# Altium schematic sheet Sensors.SchDoc
size A3; SheetNumber: 2; SheetTotal: 3
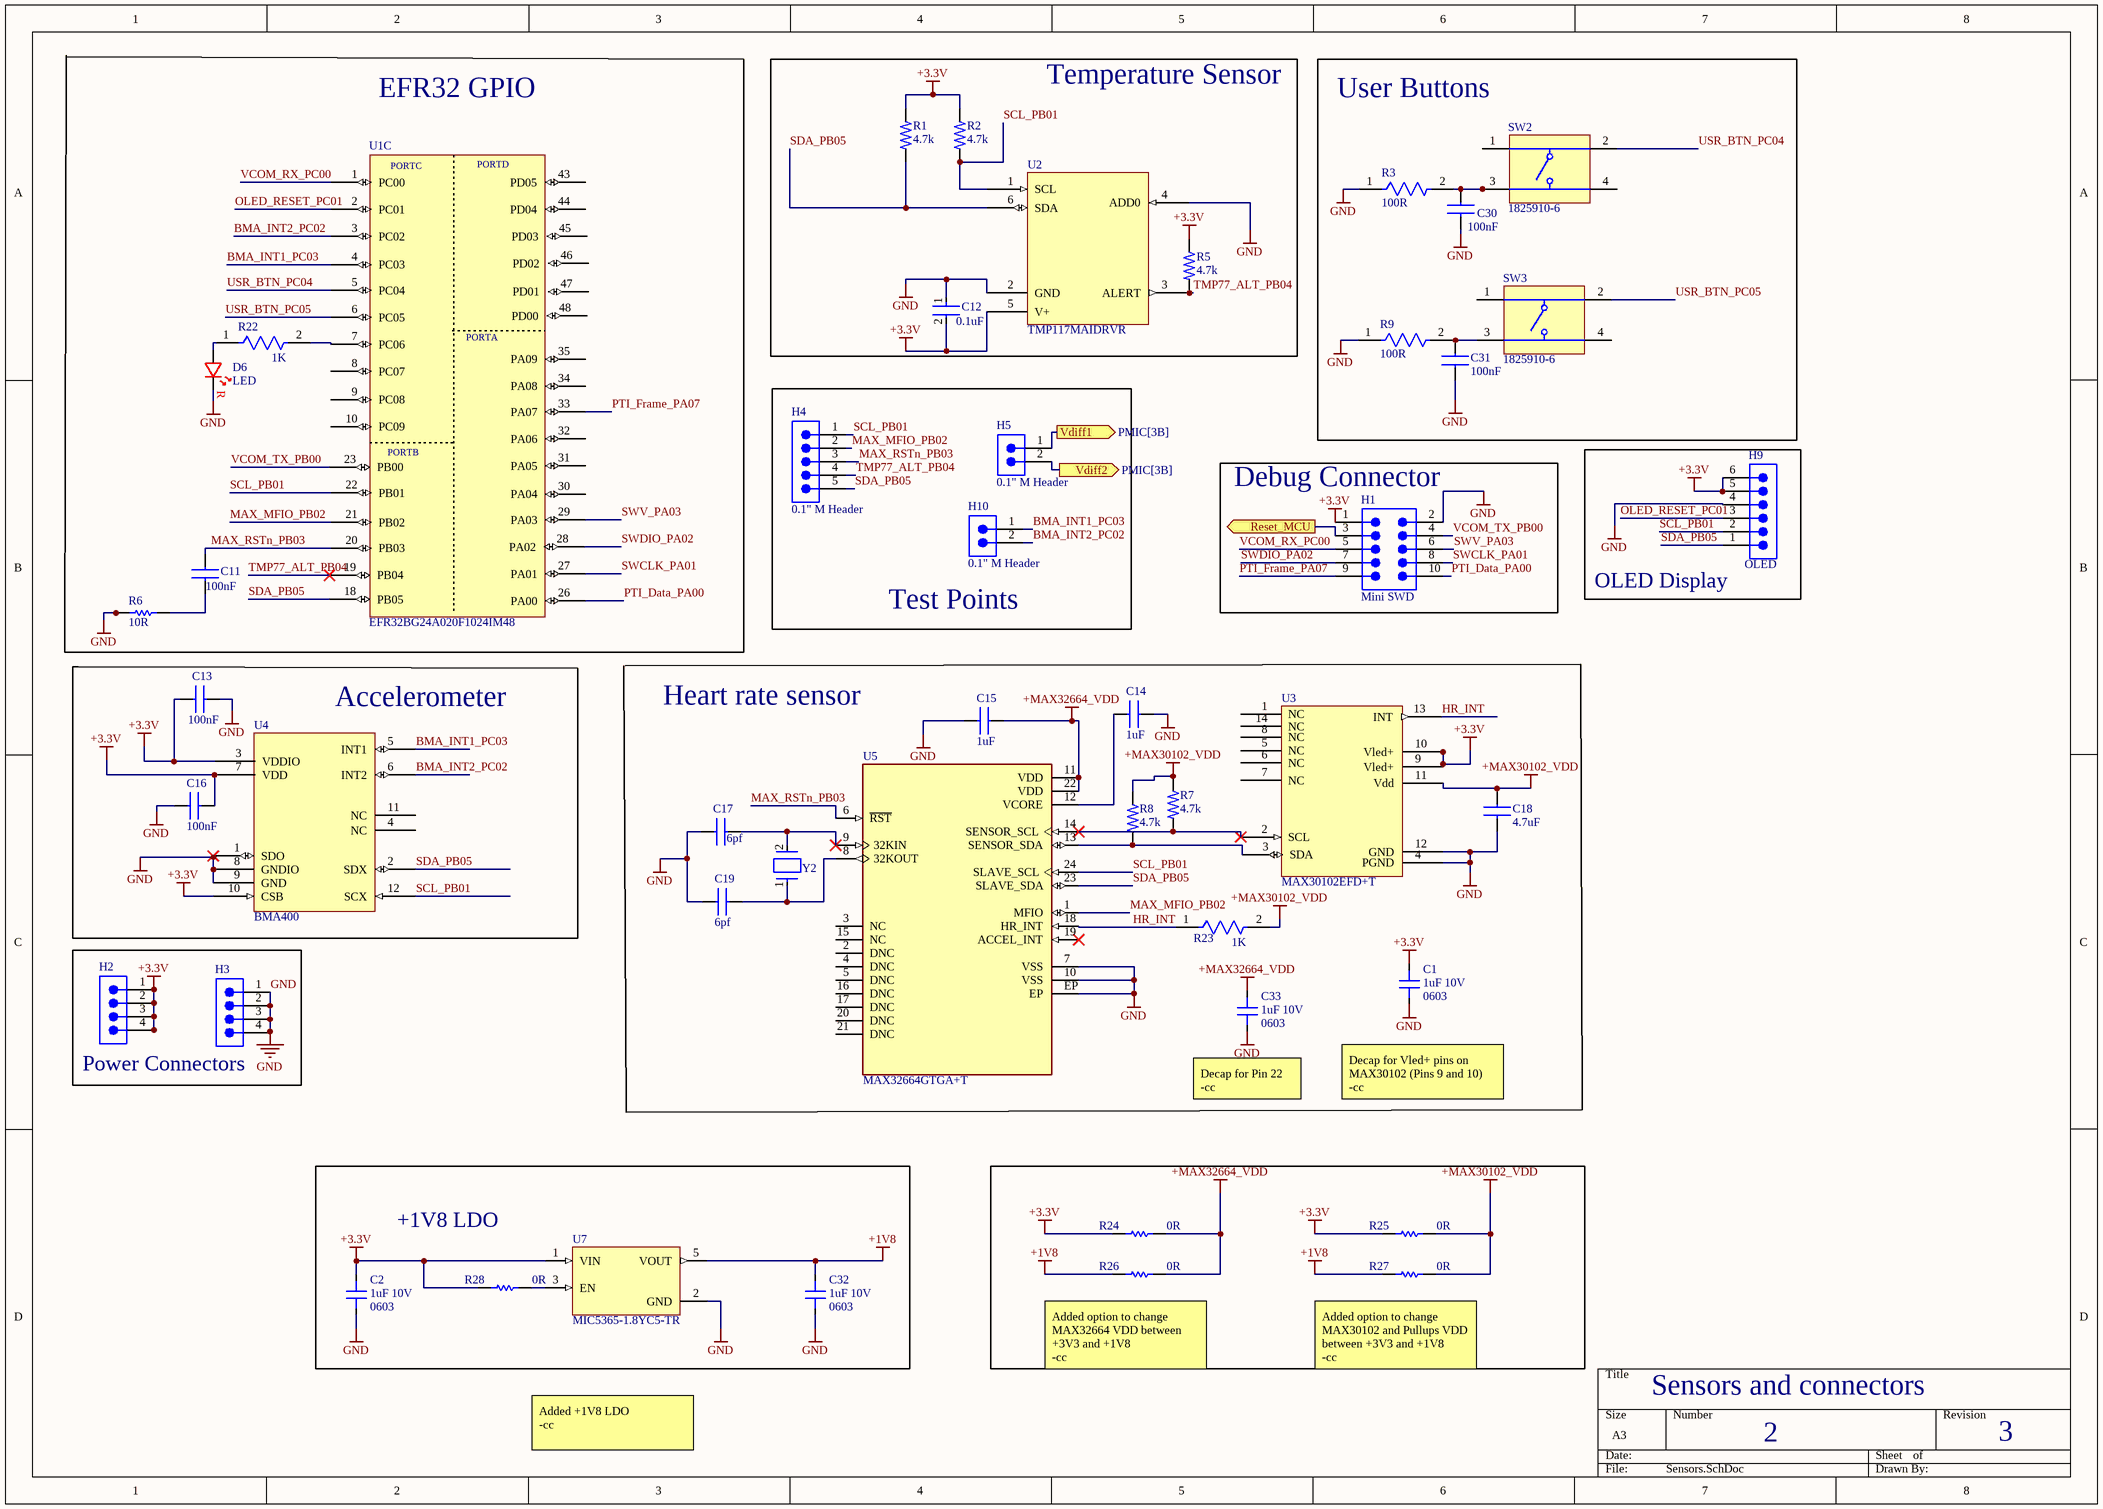
[diagram p0: Sensors.SchDoc]

## Parts
C1  1uF 10V  [CAPACITOR_0603_B_MEDIUM]
C2  1uF 10V  [CAPACITOR_0603_B_MEDIUM]
C11  100nF  [Cap_1.6X0.8_0603]
C12  0.1uF  [FP-CC0603-DA-MFG]
C13  100nF  [Cap_1.6X0.8_0603]
C14  1uF  [CAP_1uf_2x1.25_0805]
C15  1uF  [CAP_1uf_2x1.25_0805]
C16  100nF  [Cap_1.6X0.8_0603]
C17  6pf  [CAP_0603_6pf]
C18  4.7uF  [Cap_0603_4,7uf]
C19  6pf  [CAP_0603_6pf]
C30  100nF  [Cap_1.6X0.8_0603]
C31  100nF  [Cap_1.6X0.8_0603]
C32  1uF 10V  [CAPACITOR_0603_B_MEDIUM]
C33  1uF 10V  [CAPACITOR_0603_B_MEDIUM]
D6  LED  [LED_RED_1.6X0.8]
H1  Mini SWD  [FTSH-105-01-XXX-DV-K]
H2  0.1" M Header  [4-PIN_MALE_HEADER_01-IN]  (value not drawn)
H3  0.1" M Header  [4-PIN_MALE_HEADER_01-IN]  (value not drawn)
H4  0.1" M Header  [5-PIN_MALE_HEADER_01-IN]
H5  0.1" M Header  [2-PIN_MALE_HEADER_01-IN]
H9  OLED  [6-PIN_MALE_HEADER_01-IN]
H10  0.1" M Header  [2-PIN_MALE_HEADER_01-IN]
R1  4.7k  [RES_0603_160X08]
R2  4.7k  [RES_0603_160X08]
R3  100R  [FP-RC0603-0_55-MFG]
R5  4.7k  [RES_0603_160X08]
R6  10R  [RESC1608X55X25NL10T15]
R7  4.7k  [RES_0603_160X08]
R8  4.7k  [RES_0603_160X08]
R9  100R  [FP-RC0603-0_55-MFG]
R22  1K  [FP-RMCF0805-IPC_C]
R23  1K  [FP-RMCF0805-IPC_C]
R24  0R  [RESISTOR_0603]
R25  0R  [RESISTOR_0603]
R26  0R  [RESISTOR_0603]
R27  0R  [RESISTOR_0603]
R28  0R  [RESISTOR_0603]
SW2  1825910-6  [TECO-1825910-6_V]
SW3  1825910-6  [TECO-1825910-6_V]
U1  EFR32BG24A020F1024IM48  [EFR32BG24_QFN_48_6x6]  (part C of 3)
U2  TMP117MAIDRVR  [TMP117_2.1x2.1]
U3  MAX30102EFD+T  [MAX30102_SON127P600-8N]
U4  BMA400  [BMA400_2x2]
U5  MAX32664GTGA+T  [MAX32644_3x3]
U7  MIC5365-1.8YC5-TR  [SOT65P210X110-5N]
Y2  ABS07-120-32.768KHZ-T  [FP-ABS07-120-MFG]  (value not drawn)

## Blocks framed on the sheet
EFR32 GPIO: C11 D6 R6 R22 U1
Temperature Sensor: C12 R1 R2 R5 U2
User Buttons: C30 C31 R3 R9 SW2 SW3
Test Points: H4 H5 H10
OLED Display: H9
Debug Connector: H1
Accelerometer: C13 C16 U4
Heart rate sensor: C1 C14 C15 C17-C19 C33 R7 R8 R23 U3 U5 Y2
Power Connectors: H2 H3
+1V8 LDO: C2 C32 R28 U7

## Ports
Reset_MCU (out, see Radio_and_Power[1C]), Vdiff1 (out, see PMIC[3B]), Vdiff2 (out, see PMIC[3B])

## Nets
+1V8: C32.2 R26.1 R27.1 U7.5(VOUT)
+3.3V: C1.2 C2.2 C12.2 C13.1 C16.2 H1.1 H2.1 H2.2 H2.3 H2.4 H9.5 H9.6 R1.1 R2.1 R5.1 R24.1 R25.1 R28.1 U2.5(V+) U3.9(Vled+) U3.10(Vled+) U4.3(VDDIO) U4.7(VDD) U4.10(CSB) U7.1(VIN)
+MAX30102_VDD: C18.1 R7.1 R8.1 R23.2 R25.2 R27.2 U3.11(Vdd)
+MAX32664_VDD: C15.1 C33.2 R24.2 R26.2 U5.11(VDD) U5.22(VDD)
GND: C1.1 C2.1 C12.1 C13.2 C14.1 C15.2 C16.1 C17.2 C18.2 C19.2 C30.2 C31.2 C32.1 C33.1 D6.C H1.2 H3.1 H3.2 H3.3 H3.4 H9.4 R3.1 R6.1 R9.1 U2.2(GND) U2.4(ADD0) U3.4(PGND) U3.12(GND) U4.1(SDO) U4.8(GNDIO) U4.9(GND) U5.7(VSS) U5.10(VSS) U5.EP U7.2(GND)
BMA_INT1_PC03: H10.1 U1.4(PC03) U4.5(INT1)
BMA_INT2_PC02: H10.2 U1.3(PC02) U4.6(INT2)
HR_INT: R23.1 U3.13(INT) U5.18(HR_INT)
MAX_MFIO_PB02: H4.2 U1.21(PB02) U5.1(MFIO)
MAX_RSTn_PB03: C11.2 H4.3 U1.20(PB03) U5.6(~{RST})
OLED_RESET_PC01: H9.3 U1.2(PC01)
PTI_Data_PA00: H1.10 U1.26(PA00)
PTI_Frame_PA07: H1.9 U1.33(PA07)
Reset_MCU: H1.3 ; port Reset_MCU
SCL_PB01: H4.1 H9.2 R2.2 U1.22(PB01) U2.1(SCL) U4.12(SCX) U5.24(SLAVE_SCL)
SDA_PB05: H4.5 H9.1 R1.2 U1.18(PB05) U2.6(SDA) U4.2(SDX) U5.23(SLAVE_SDA)
SWCLK_PA01: H1.8 U1.27(PA01)
SWDIO_PA02: H1.7 U1.28(PA02)
SWV_PA03: H1.6 U1.29(PA03)
TMP77_ALT_PB04: H4.4 R5.2 U1.19(PB04) U2.3(ALERT)
USR_BTN_PC04: SW2.2 U1.5(PC04)
USR_BTN_PC05: SW3.2 U1.6(PC05)
VCOM_RX_PC00: H1.5 U1.1(PC00)
VCOM_TX_PB00: H1.4 U1.23(PB00)
Vdiff1: H5.1 ; port Vdiff1
Vdiff2: H5.2 ; port Vdiff2
NetC11_1: C11.1 R6.2
NetC14_2: C14.2 U5.12(VCORE)
NetC17_1: C17.1 U5.9(32KIN) Y2.2
NetC19_1: C19.1 U5.8(32KOUT) Y2.1
NetC30_1: C30.1 R3.2 SW2.3
NetC31_1: C31.1 R9.2 SW3.3
NetD6_A: D6.A R22.1
NetR7_2: R7.2 U3.2(SCL) U5.14(SENSOR_SCL)
NetR8_2: R8.2 U3.3(SDA) U5.13(SENSOR_SDA)
NetR22_2: R22.2 U1.7(PC06)
NetR28_2: R28.2 U7.3(EN)

Not connected (* = marked no-connect by the designer): SW2 1 4; SW3 1 4; U1 8(PC07) 9(PC08) 10(PC09) 30(PA04) 31(PA05) 32(PA06) 34(PA08) 35(PA09) 43(PD05) 44(PD04) 45(PD03) 46(PD02) 47(PD01) 48(PD00); U3 1(NC) 5(NC) 6(NC) 7(NC) 8(NC) 14(NC); U4 4(NC) 11(NC); U5 2(DNC) 3(NC) 4(DNC) 5(DNC) 15(NC) 16(DNC) 17(DNC) 19(ACCEL_INT)* 20(DNC) 21(DNC)

## Notes on the sheet
- (near C33) Decap for Pin 22
  -cc
- (near C1) Decap for Vled+ pins on MAX30102 (Pins 9 and 10)
  -cc
- (near R26) Added option to change MAX32664 VDD between +3V3 and +1V8
  -cc
- (near R27) Added option to change MAX30102 and Pullups VDD between +3V3 and +1V8
  -cc
- Sensors and connectors
- Added +1V8 LDO
  -cc
- 2
- 3
- (in symbol EFR32BG24A020F1024IM48-B, part C) PORTC; PORTD; PORTA; PORTB
- (in symbol LED_1.6x0.8) R

## Library data of the parts
C1 C2 C32 C33 = C_1uF_0603: Ceramic Capacitor, Multilayer, Ceramic, 10V, 10% +Tol, 10% -Tol, X7R, 15% TC, 1uF, Surface Mount, 0603; Manufacturer: Samsung; Manufacturer Part Number: CL10B105KP8NNNC; Multilayer: Yes; Supplier: Digikey; Supplier Part Number: 1276-1946-1-ND; RoHS: Yes; Category: Ceramic Capacitors; Stock: 6613656; Pricing: 1=0.1, 10=0.032, 50=0.0214, 100=0.0183, 500=0.01298, 1000=0.01133, 4000=0.0071, 8000=0.00636, 12000=0.00599, 20000=0.00558, 28000=0.00533, 40000=0.0051, 100000=0.0046, 200000=0.00431 (USD); Mounting Technology: Surface Mount; Pins: 2; Dielectric Material: Ceramic; Package Shape: Rectangular; Case/Package: 0603; Terminal Finish: Nickel; Min Operating Temperature: -55°C; Max Operating Temperature: 125°C; JESD-609 Code: e3; Value: 1uF; Capacitor Type: Ceramic; Tolerance  (fill in as +-): 10%; Package Style: SMTMeter; Packaging: Tape and Reel; Tolerance (fill in as +-): 10%; Rated DC Voltage (URdc): 10V; Temperature Characteristics Code: X7R; Termination: Wraparound; Length: 1.6mm; Width: 0.8mm; Height: 0.9mm; Reach SVHC Compliant: Yes; RoHS Compliant: Yes; ComponentLink1URL: https://datasheet.ciiva.com:443/pdfs/VipMasterIC/IC/SEMS/SEMS-S-A0008526420/SEMS-S-A0008526450-1.pdf?src-supplier=IHS+Markit; ComponentLink1Description: https://datasheet.ciiva.com:443/pdfs/VipMasterIC/IC/SEMS/SEMS-S-A0008526420/SEMS-S-A0008526450-1.pdf?src-supplier=IHS+Markit; ComponentLink2URL: https://datasheet.ciiva.com/25788/cl10b105kp8nnnc-25788304.pdf?src-supplier=Digikey; ComponentLink2Description: https://datasheet.ciiva.com/25788/cl10b105kp8nnnc-25788304.pdf?src-supplier=Digikey; ComponentLink3URL: https://datasheet.ciiva.com/26838/getdatasheetpartid-358410-26838426.pdf?src-supplier=Verical; ComponentLink3Description: https://datasheet.ciiva.com/26838/getdatasheetpartid-358410-26838426.pdf?src-supplier=Verical; ComponentLink4URL: https://datasheet.ciiva.com/16396/cl10b105kp8nnnc-16396970.pdf?src-supplier=Future+Electronics; ComponentLink4Description: https://datasheet.ciiva.com/16396/cl10b105kp8nnnc-16396970.pdf?src-supplier=Future+Electronics; Supplier 1: Digikey; Supplier Part Number 1: 1276-1946-1-ND
C11 C13 C16 C30 C31 = Cap_0603: Ceramic Capacitor, Multilayer, Ceramic, 16V, 10% +Tol, 10% -Tol, X7R, 15% TC, 0.1uF, Surface Mount, 0603; Manufacturer: Yageo; Manufacturer Part Number: CC0603KRX7R7BB104; Multilayer: Yes; Supplier: Digikey; Supplier Part Number: 311-1088-1-ND; RoHS: Yes; Category: Ceramic Capacitors; Stock: 8597381; Pricing: 1=0.1, 10=0.042, 50=0.0238, 100=0.0185, 500=0.01392, 1000=0.01094, 4000=0.00915, 8000=0.00836, 12000=0.00796, 28000=0.00756, 100000=0.00547, 200000=0.00529, 400000=0.00497 (USD); Mounting Technology: Surface Mount; Pins: 2; Dielectric Material: Ceramic; Package Shape: Rectangular; Case/Package: 0603; Terminal Finish: Nickel; Min Operating Temperature: -55°C; Max Operating Temperature: 125°C; JESD-609 Code: e3; Value: 100nF; Capacitor Type: Ceramic; Tolerance  (fill in as +-): 10%; Package Style: SMTMeter; Packaging: Tape and Reel; Tolerance (fill in as +-): 10%; Rated DC Voltage (URdc): 16V; Temperature Characteristics Code: X7R; Termination: Wraparound; Length: 1.6mm; Width: 0.8mm; Height: 0.8mm; Reach SVHC Compliant: Yes; RoHS Compliant: Yes; ComponentLink1URL: https://datasheet.ciiva.com:443/pdfs/VipMasterIC/IC/YAGO/YAGO-S-A0003557223/YAGO-S-A0003557223-1.pdf?src-supplier=IHS+Markit; ComponentLink1Description: https://datasheet.ciiva.com:443/pdfs/VipMasterIC/IC/YAGO/YAGO-S-A0003557223/YAGO-S-A0003557223-1.pdf?src-supplier=IHS+Markit; ComponentLink2URL: https://datasheet.ciiva.com/11786/0900766b80d84f1d-11786077.pdf?src-supplier=Rs; ComponentLink2Description: https://datasheet.ciiva.com/11786/0900766b80d84f1d-11786077.pdf?src-supplier=Rs; ComponentLink3URL: https://datasheet.ciiva.com/46430/1734573-46430156.pdf?src-supplier=Element14; ComponentLink3Description: https://datasheet.ciiva.com/46430/1734573-46430156.pdf?src-supplier=Element14; ComponentLink4URL: https://datasheet.ciiva.com/8033/1734573-8033797.pdf?src-supplier=Element14; ComponentLink4Description: https://datasheet.ciiva.com/8033/1734573-8033797.pdf?src-supplier=Element14; ComponentLink5URL: https://datasheet.ciiva.com/8033/70765-8033799.pdf?src-supplier=Element14; ComponentLink5Description: https://datasheet.ciiva.com/8033/70765-8033799.pdf?src-supplier=Element14; ComponentLink6URL: https://datasheet.ciiva.com/28450/1489800-28450552.pdf?src-supplier=Element14; ComponentLink6Description: https://datasheet.ciiva.com/28450/1489800-28450552.pdf?src-supplier=Element14; ComponentLink7URL: https://datasheet.ciiva.com/144/mlccorderingcode-144182.pdf?src-supplier=Digikey; ComponentLink7Description: https://datasheet.ciiva.com/144/mlccorderingcode-144182.pdf?src-supplier=Digikey; ComponentLink8URL: https://datasheet.ciiva.com/144/mlccorderingcode-144183.pdf?src-supplier=Digikey; ComponentLink8Description: https://datasheet.ciiva.com/144/mlccorderingcode-144183.pdf?src-supplier=Digikey; ComponentLink9URL: https://datasheet.ciiva.com/144/mlccorderingcode-144184.pdf?src-supplier=Digikey; ComponentLink9Description: https://datasheet.ciiva.com/144/mlccorderingcode-144184.pdf?src-supplier=Digikey; ComponentLink10URL: https://datasheet.ciiva.com/11464/upy-gphc-x7r-6-3v-to-50v-8-11464735.pdf?src-supplier=Avnet; ComponentLink10Description: https://datasheet.ciiva.com/11464/upy-gphc-x7r-6-3v-to-50v-8-11464735.pdf?src-supplier=Avnet; ComponentLink11URL: https://datasheet.ciiva.com/13395/upy-gphc-x7r-6-3v-to-50v-8-13395674.pdf?src-supplier=Mouser; ComponentLink11Description: https://datasheet.ciiva.com/13395/upy-gphc-x7r-6-3v-to-50v-8-13395674.pdf?src-supplier=Mouser; ComponentLink12URL: https://datasheet.ciiva.com/7978/1489800-7978141.pdf?src-supplier=Element14; ComponentLink12Description: https://datasheet.ciiva.com/7978/1489800-7978141.pdf?src-supplier=Element14
C12 = CMP-2000-05002-2: CAP CER 0.1UF 16V X7R 0603; Manufacturer Part Number: CC0603KRX7R7BB104; Manufacturer: YAGEO; Tolerance: 0.1; Value: 100 nF; Temperature Coefficient: 15%; Material: Ceramic; Multilayer: Yes; Tolerance  (fill in as +-): 10%; Voltage Rating: 16 V; Package: CC0603-DA; ComponentLink2Description: Datasheet; Octopart: https://octopart.com/cc0603krx7r7bb104-yageo-192941; Temperature Range High: +125°C; Digikey Description: CAP CER 0.1UF 16V X7R 0603; Voltage: 16 V; Device Class L2: Capacitors; Height: 0.9mm; Temperature: -55°C to +125°C; Device Class L1: Passive Components; Device Class L3: Ceramic Capacitors; ComponentLink2URL: http://www.yageo.com/documents/recent/UPY-GPHC_X7R_6.3V-to-50V_18.pdf; Footprint Url: http://www.yageo.com/exep/pages/download/literatures/UPY-C_GEN_24.pdf; RoHS: TRUE; Temperature Range Low: -55°C; Temperature Characteristic: X7R; Lead Free: Yes; Capacitance: 100 nF; Category: Cap; Mouser Description: Multilayer Ceramic Capacitor, CC Series, 0.1 - F, - 10%, X7R, 16 V, 0603 [1608 Metric]; Automotive: No; Supplier: Digikey; Supplier Part Number: 311-1088-1-ND; Stock: 8462110; Pricing: 1=0.1, 10=0.042, 50=0.0238, 100=0.0185, 500=0.01392, 1000=0.01094, 4000=0.00989, 8000=0.00888, 12000=0.00837, 20000=0.0078, 28000=0.00747, 40000=0.00715, 100000=0.00646, 200000=0.00604, 400000=0.0057 (USD); Mounting Technology: Surface Mount; Pins: 2; Dielectric Material: Ceramic; Package Shape: Rectangular; Case/Package: 0603; Terminal Finish: Nickel; Min Operating Temperature: -55°C; Max Operating Temperature: 125°C; JESD-609 Code: e3; Capacitor Type: Ceramic; Package Style: SMTMeter; Packaging: Tape and Reel; Tolerance (fill in as +-): 10%; Rated DC Voltage (URdc): 16V; Temperature Characteristics Code: X7R; Termination: Wraparound; Length: 1.6mm; Width: 0.8mm; Reach SVHC Compliant: Yes; RoHS Compliant: Yes; ComponentLink1URL: https://datasheet.ciiva.com:443/pdfs/VipMasterIC/IC/YAGO/YAGO-S-A0003557223/YAGO-S-A0003557223-1.pdf?src-supplier=IHS+Markit; ComponentLink1Description: https://datasheet.ciiva.com:443/pdfs/VipMasterIC/IC/YAGO/YAGO-S-A0003557223/YAGO-S-A0003557223-1.pdf?src-supplier=IHS+Markit; ComponentLink3URL: https://datasheet.ciiva.com/11786/0900766b80d84f1d-11786077.pdf?src-supplier=Rs; ComponentLink3Description: https://datasheet.ciiva.com/11786/0900766b80d84f1d-11786077.pdf?src-supplier=Rs; ComponentLink4URL: https://datasheet.ciiva.com/46430/1734573-46430156.pdf?src-supplier=Element14; ComponentLink4Description: https://datasheet.ciiva.com/46430/1734573-46430156.pdf?src-supplier=Element14; ComponentLink5URL: https://datasheet.ciiva.com/8033/1734573-8033797.pdf?src-supplier=Element14; ComponentLink5Description: https://datasheet.ciiva.com/8033/1734573-8033797.pdf?src-supplier=Element14; ComponentLink6URL: https://datasheet.ciiva.com/8033/70765-8033799.pdf?src-supplier=Element14; ComponentLink6Description: https://datasheet.ciiva.com/8033/70765-8033799.pdf?src-supplier=Element14; ComponentLink7URL: https://datasheet.ciiva.com/28450/1489800-28450552.pdf?src-supplier=Element14; ComponentLink7Description: https://datasheet.ciiva.com/28450/1489800-28450552.pdf?src-supplier=Element14; ComponentLink8URL: https://datasheet.ciiva.com/144/mlccorderingcode-144182.pdf?src-supplier=Digikey; ComponentLink8Description: https://datasheet.ciiva.com/144/mlccorderingcode-144182.pdf?src-supplier=Digikey; ComponentLink9URL: https://datasheet.ciiva.com/144/mlccorderingcode-144183.pdf?src-supplier=Digikey; ComponentLink9Description: https://datasheet.ciiva.com/144/mlccorderingcode-144183.pdf?src-supplier=Digikey; ComponentLink10URL: https://datasheet.ciiva.com/144/mlccorderingcode-144184.pdf?src-supplier=Digikey; ComponentLink10Description: https://datasheet.ciiva.com/144/mlccorderingcode-144184.pdf?src-supplier=Digikey; ComponentLink11URL: https://datasheet.ciiva.com/11464/upy-gphc-x7r-6-3v-to-50v-8-11464735.pdf?src-supplier=Avnet; ComponentLink11Description: https://datasheet.ciiva.com/11464/upy-gphc-x7r-6-3v-to-50v-8-11464735.pdf?src-supplier=Avnet; ComponentLink12URL: https://datasheet.ciiva.com/13395/upy-gphc-x7r-6-3v-to-50v-8-13395674.pdf?src-supplier=Mouser; ComponentLink12Description: https://datasheet.ciiva.com/13395/upy-gphc-x7r-6-3v-to-50v-8-13395674.pdf?src-supplier=Mouser; ComponentLink13URL: https://datasheet.ciiva.com/7978/1489800-7978141.pdf?src-supplier=Element14; ComponentLink13Description: https://datasheet.ciiva.com/7978/1489800-7978141.pdf?src-supplier=Element14
C14 C15 = Cap_0805: Multilayer Ceramic Capacitor, 1 uF, 25 V, ï¿½ 10%, X7R, 0805 [2012 Metric]; Manufacturer: Samsung; Manufacturer Part Number: CL21B105KAFNNNE; Voltage: 25V; Supplier: Digikey; Supplier Part Number: 1276-1066-1-ND; RoHS: Yes; Category: Ceramic Capacitors; Stock: 1207799; Pricing: 1=0.1, 10=0.062, 50=0.0356, 100=0.0276, 500=0.02078, 1000=0.01633 (USD); Mounting Technology: Surface Mount; Case/Package: 0805; Case Code (Metric): 2012; Case Code (Imperial): 0805; Min Operating Temperature: -55°C; Max Operating Temperature: 125°C; Value: 1uF; Tolerance: 10%; Dielectric: X7R; Voltage Rating (DC): 25V; Series: CL; Packaging: Tape and Reel; Voltage Rating: 25V; Package Quantity: 1; Construction: Flat; Length: 2mm; Width: 0.049inch; Height: 1.25mm; Depth: 1.25mm; Thickness: 0.053inch; Radiation Hardening: No; Lead Free: Lead Free; RoHS Compliant: Yes; ComponentLink1URL: https://datasheet.ciiva.com/25800/cl21b105kafnnne-25800163.pdf?src-supplier=Digikey; ComponentLink1Description: https://datasheet.ciiva.com/25800/cl21b105kafnnne-25800163.pdf?src-supplier=Digikey; ComponentLink2URL: https://datasheet.ciiva.com/15195/getdatasheetpartid-355205-15195880.pdf?src-supplier=Verical; ComponentLink2Description: https://datasheet.ciiva.com/15195/getdatasheetpartid-355205-15195880.pdf?src-supplier=Verical
C17 C19 = Cap_0603_6pf: Ceramic Capacitor, Multilayer, Ceramic, 50V, 8.33% +Tol, 8.33% -Tol, C0G, -/+30ppm/Cel TC, 0.000006uF, Surface Mount, 0603; Manufacturer: Samsung; Manufacturer Part Number: CL10C060DB8NNNC; Multilayer: Yes; Supplier: Digikey; Supplier Part Number: 1276-2134-1-ND; RoHS: Yes; Category: Ceramic Capacitors; Stock: 556536; Pricing: 1=0.1, 10=0.029, 50=0.0166, 100=0.0129, 500=0.00974, 1000=0.00765 (USD); Mounting Technology: Surface Mount; Pins: 2; Dielectric Material: Ceramic; Package Shape: Rectangular; Case/Package: 0603; Terminal Finish: Nickel; Min Operating Temperature: -55°C; Max Operating Temperature: 125°C; JESD-609 Code: e3; Value: 6pF; Capacitor Type: Ceramic; Tolerance  (fill in as +-): 8.33%; Package Style: SMTMeter; Packaging: Tape and Reel; Tolerance (fill in as +-): 8.33%; Rated DC Voltage (URdc): 50V; Temperature Characteristics Code: C0G; Termination: Wraparound; Length: 1.6mm; Width: 0.8mm; Height: 0.9mm; Reach SVHC Compliant: Yes; RoHS Compliant: Yes; ComponentLink1URL: https://datasheet.ciiva.com:443/pdfs/VipMasterIC/IC/SEMS/SEMS-S-A0008521003/SEMS-S-A0008521032-1.pdf?src-supplier=IHS+Markit; ComponentLink1Description: https://datasheet.ciiva.com:443/pdfs/VipMasterIC/IC/SEMS/SEMS-S-A0008521003/SEMS-S-A0008521032-1.pdf?src-supplier=IHS+Markit; ComponentLink2URL: https://datasheet.ciiva.com/25737/cl10c060db8nnnc-25737489.pdf?src-supplier=Digikey; ComponentLink2Description: https://datasheet.ciiva.com/25737/cl10c060db8nnnc-25737489.pdf?src-supplier=Digikey
C18 = Cap_0603_4.7uf: Ceramic Capacitor, Multilayer, Ceramic, 10V, 10% +Tol, 10% -Tol, X5R, 15% TC, 4.7uF, Surface Mount, 0603; Manufacturer: Samsung; Manufacturer Part Number: CL10A475KP8NNNC; Multilayer: Yes; Supplier: Digikey; Supplier Part Number: 1276-1044-1-ND; RoHS: Yes; Category: Ceramic Capacitors; Stock: 6782478; Pricing: 1=0.1, 10=0.041, 50=0.0234, 100=0.0182, 500=0.01368, 1000=0.01075, 4000=0.00899, 8000=0.00821, 12000=0.00782, 28000=0.00743, 100000=0.00537, 200000=0.0052, 400000=0.00489 (USD); Mounting Technology: Surface Mount; Pins: 2; Dielectric Material: Ceramic; Package Shape: Rectangular; Case/Package: 0603; Terminal Finish: Nickel; Min Operating Temperature: -55°C; Max Operating Temperature: 85°C; JESD-609 Code: e3; Value: 4.7uF; Capacitor Type: Ceramic; Tolerance  (fill in as +-): 10%; Package Style: SMTMeter; Packaging: Tape and Reel; Tolerance (fill in as +-): 10%; Rated DC Voltage (URdc): 10V; Temperature Characteristics Code: X5R; Termination: Wraparound; Length: 1.6mm; Width: 0.8mm; Height: 0.5mm; Reach SVHC Compliant: Yes; RoHS Compliant: Yes; ComponentLink1URL: https://datasheet.ciiva.com:443/pdfs/VipMasterIC/IC/SEMS/SEMS-S-A0008521003/SEMS-S-A0008520862-1.pdf?src-supplier=IHS+Markit; ComponentLink1Description: https://datasheet.ciiva.com:443/pdfs/VipMasterIC/IC/SEMS/SEMS-S-A0008521003/SEMS-S-A0008520862-1.pdf?src-supplier=IHS+Markit; ComponentLink2URL: https://datasheet.ciiva.com/25797/cl10a475kp8nnnc-25797520.pdf?src-supplier=Digikey; ComponentLink2Description: https://datasheet.ciiva.com/25797/cl10a475kp8nnnc-25797520.pdf?src-supplier=Digikey; ComponentLink3URL: https://datasheet.ciiva.com/26838/getdatasheetpartid-358676-26838384.pdf?src-supplier=Verical; ComponentLink3Description: https://datasheet.ciiva.com/26838/getdatasheetpartid-358676-26838384.pdf?src-supplier=Verical; ComponentLink4URL: https://datasheet.ciiva.com/16318/cl05b104kq5nnnc-16318245.pdf?src-supplier=Future+Electronics; ComponentLink4Description: https://datasheet.ciiva.com/16318/cl05b104kq5nnnc-16318245.pdf?src-supplier=Future+Electronics
D6 = LED_1.6x0.8: LED Low-Power Uni-Color Red 630nm 2V 2-Pin Chip 0603(1608Metric) T/R; Manufacturer: Wurth Electronics; Manufacturer Part Number: 150060RS75000; Lens Color: Colorless; Viewing Angle: 140°; Lens Style: Clear,Flat,Rectangular; Luminous Intensity: 250mcd; Forward Current: 30mA; Wavelength: 625nm; Test Current: 20mA; Lens Transparency: Clear; Max Reverse Voltage (DC): 5V; Power Dissipation: 72mW; Lens Size: 0.7mm; Supplier: Digikey; Supplier Part Number: 732-4978-1-ND; RoHS: Yes; Category: LEDs; Stock: 135692; Pricing: 1=0.15, 50=0.142, 100=0.122, 500=0.105, 1000=0.10125 (USD); Mounting Technology: Surface Mount; Case/Package: 0603; Color: Red; Case Code (Metric): 1608; Case Code (Imperial): 0603; Min Operating Temperature: -40°C; Max Operating Temperature: 85°C; Package Quantity: 1; Packaging: Cut Tape; Forward Voltage: 2V; Dominant Wavelength: 625nm; Series: WL-SMCW; Reverse Voltage: 5V; Length: 1.6mm; Width: 0.8mm; Height: 0.8mm; RoHS Compliant: Yes; Reach SVHC Compliant: Unknown; ComponentLink1URL: https://datasheet.ciiva.com/29563/150060rs75000-29563040.pdf?src-supplier=Digikey; ComponentLink1Description: https://datasheet.ciiva.com/29563/150060rs75000-29563040.pdf?src-supplier=Digikey
H1 = Debug Connector Mini SWD - 0.05": Mini SWD 0.05" Pitch Connector - 10 Pin SMT Box Header; Manufacturer: Adafruit Industries; Manufacturer Part Number: 4048; Supplier 1: Digi-Key; RoHS: No; Category: Connectors; Stock 1: 201; Pricing 1: 1=1.95000 (USD); ComponentLink1URL: https://media.digikey.com/pdf/Data%20Sheets/Adafruit%20PDFs/4048_Web.pdf?src-supplier=Digi-Key; ComponentLink1Description: https://media.digikey.com/pdf/Data%20Sheets/Adafruit%20PDFs/4048_Web.pdf?src-supplier=Digi-Key
H2 H3 = PRPC004SAAN-RC: CONN HEADER VERT 4POS 2.54MM; Manufacturer: Sullins; Connector Type: Header, Unshrouded, Breakaway; Number of Positions: 4; Number of Positions Loaded: All; Pitch: 0.100" (2.54mm); Online Catalog: 0.100" (2.54mm) Pitch Connector Headers; Other Names: S9510E-04  S9510E-04-ND; Supplier 1: Digi-Key; Manufacturer Part Number: PRPC004SAAN-RC; Stock 1: 6306; Pricing 1: 1=0.15, 10=0.146, 25=0.1084, 50=0.0928, 100=0.0898, 250=0.0774, 500=0.0743 (USD); Standard Package: 1; Category: Connectors, Interconnects; Family: Rectangular Connectors - Headers, Male Pins; Series: -; Packaging: Bulk; Contact Type: Male Pin; Number of Rows: 1; Row Spacing: -; Contact Mating Length: 0.230" (5.84mm); Mounting Type: Through Hole; Termination: Solder; Fastening Type: -; Features: -; Contact Finish: Gold; Contact Finish Thickness: Flash; Color: Black; ComponentLink1URL: https://media.digikey.com/PDF/Data%20Sheets/Sullins%20PDFs/xRxCzzzSxxN-RC_ST_11635-B.pdf?src-supplier=Digi-Key; ComponentLink1Description: https://media.digikey.com/PDF/Data%20Sheets/Sullins%20PDFs/xRxCzzzSxxN-RC_ST_11635-B.pdf?src-supplier=Digi-Key; Supplier Part Number 1: S1011EC-04-ND
H4 = PRPC005SAAN-RC: CONN HEADER VERT 5POS 2.54MM; Manufacturer: Sullins; Connector Type: Header, Unshrouded, Breakaway; Number of Positions: 5; Number of Positions Loaded: All; Pitch: 0.100" (2.54mm); Online Catalog: 0.100" (2.54mm) Pitch Connector Headers; Other Names: S9510E-05  S9510E-05-ND; Supplier 1: Digi-Key; Manufacturer Part Number: PRPC005SAAN-RC; Stock 1: 9728; Pricing 1: 1=0.19, 10=0.182, 25=0.1356, 50=0.1162, 100=0.1122, 250=0.0968, 500=0.0929 (USD); Standard Package: 1; Category: Connectors, Interconnects; Family: Rectangular Connectors - Headers, Male Pins; Series: -; Packaging: Bulk; Contact Type: Male Pin; Number of Rows: 1; Row Spacing: -; Contact Mating Length: 0.230" (5.84mm); Mounting Type: Through Hole; Termination: Solder; Fastening Type: -; Features: -; Contact Finish: Gold; Contact Finish Thickness: Flash; Color: Black; ComponentLink1URL: https://media.digikey.com/PDF/Data%20Sheets/Sullins%20PDFs/xRxCzzzSxxN-RC_ST_11635-B.pdf?src-supplier=Digi-Key; ComponentLink1Description: https://media.digikey.com/PDF/Data%20Sheets/Sullins%20PDFs/xRxCzzzSxxN-RC_ST_11635-B.pdf?src-supplier=Digi-Key; Supplier Part Number 1: S1011EC-05-ND
H5 H10 = PRPC002SAAN-RC: CONN HEADER VERT 2POS 2.54MM; Manufacturer: Sullins; Connector Type: Header, Unshrouded, Breakaway; Number of Positions: 2; Number of Positions Loaded: All; Pitch: 0.100" (2.54mm); Online Catalog: 0.100" (2.54mm) Pitch Connector Headers; Other Names: S9510E-02  S9510E-02-ND; Supplier 1: Digi-Key; Manufacturer Part Number: PRPC002SAAN-RC; Stock 1: 42739; Pricing 1: 1=0.08, 10=0.073, 25=0.054, 50=0.0464, 100=0.0449, 250=0.0387, 500=0.0372 (USD); Standard Package: 1; Category: Connectors, Interconnects; Family: Rectangular Connectors - Headers, Male Pins; Series: -; Packaging: Bulk; Contact Type: Male Pin; Number of Rows: 1; Row Spacing: -; Contact Mating Length: 0.230" (5.84mm); Mounting Type: Through Hole; Termination: Solder; Fastening Type: -; Features: -; Contact Finish: Gold; Contact Finish Thickness: Flash; Color: Black; ComponentLink1URL: https://media.digikey.com/PDF/Data%20Sheets/Sullins%20PDFs/xRxCzzzSxxN-RC_ST_11635-B.pdf?src-supplier=Digi-Key; ComponentLink1Description: https://media.digikey.com/PDF/Data%20Sheets/Sullins%20PDFs/xRxCzzzSxxN-RC_ST_11635-B.pdf?src-supplier=Digi-Key; Supplier Part Number 1: S1011EC-02-ND
H9 = PRPC006SAAN-RC: CONN HEADER VERT 6POS 2.54MM; Manufacturer: Sullins; Connector Type: Header, Unshrouded, Breakaway; Number of Positions: 6; Number of Positions Loaded: All; Pitch: 0.100" (2.54mm); Online Catalog: 0.100" (2.54mm) Pitch Connector Headers; Other Names: S9510E-06  S9510E-06-ND; Supplier 1: Digi-Key; Manufacturer Part Number: PRPC006SAAN-RC; Stock 1: 1567; Pricing 1: 1=0.19, 10=0.174, 25=0.1488, 50=0.13, 100=0.1207, 250=0.1068, 500=0.1022 (USD); Standard Package: 1; Category: Connectors, Interconnects; Family: Rectangular Connectors - Headers, Male Pins; Series: -; Packaging: Bulk; Contact Type: Male Pin; Number of Rows: 1; Row Spacing: -; Contact Mating Length: 0.230" (5.84mm); Mounting Type: Through Hole; Termination: Solder; Fastening Type: -; Features: -; Contact Finish: Gold; Contact Finish Thickness: Flash; Color: Black; ComponentLink1URL: https://media.digikey.com/PDF/Data%20Sheets/Sullins%20PDFs/xRxCzzzSxxN-RC_ST_11635-B.pdf?src-supplier=Digi-Key; ComponentLink1Description: https://media.digikey.com/PDF/Data%20Sheets/Sullins%20PDFs/xRxCzzzSxxN-RC_ST_11635-B.pdf?src-supplier=Digi-Key; Supplier Part Number 1: S1011EC-06-ND
R1 R2 R5 R7 R8 = Resistor_0603: SMD Chip Resistor, 4.7 kOhm, ï¿½ 1%, 100 mW, 0603 [1608 Metric], Thick Film, General Purpose; Manufacturer: Yageo; Manufacturer Part Number: RC0603FR-074K7L; Value: 4.7kR; Power Rating: 100mW; Voltage Rating: 50V; Temperature Coefficient: 100ppm/°C; Supplier: Digikey; Supplier Part Number: 311-4.70KHRCT-ND; RoHS: Yes; Category: Chip SMD Resistors; Stock: 2306759; Pricing: 1=0.1, 10=0.019, 50=0.0112, 100=0.0093, 500=0.00622, 1000=0.00532 (USD); Case/Package: 0603; Pins: 2; Case Code (Imperial): 0603; Case Code (Metric): 1608; Min Operating Temperature: -55°C; Max Operating Temperature: 155°C; Packaging: Tape and Reel; Tolerance: 1%; Voltage Rating (DC): 50V; Termination: SMD/SMT; Resistor Type: Thick Film; Features: Moisture Resistant; Series: RC; Max Power Dissipation: 100mW; Number of Terminations: 2; Resistance Tolerance: 1%; Construction: Rectangular; Length: 1.6mm; Width: 0.8mm; Depth: 0.8mm; Lead Pitch: 0.3mm; Lead Free: Lead Free; RoHS Compliant: Yes; Reach SVHC Compliant: Unknown; Military Standard: Not; ComponentLink1URL: https://datasheet.ciiva.com/15189/getdatasheetpartid-422754-15189760.pdf?src-supplier=Verical; ComponentLink1Description: https://datasheet.ciiva.com/15189/getdatasheetpartid-422754-15189760.pdf?src-supplier=Verical; ComponentLink2URL: https://datasheet.ciiva.com/46440/1868787-46440909.pdf?src-supplier=Element14; ComponentLink2Description: https://datasheet.ciiva.com/46440/1868787-46440909.pdf?src-supplier=Element14; ComponentLink3URL: https://datasheet.ciiva.com/7660/38590-7660794.pdf?src-supplier=Element14; ComponentLink3Description: https://datasheet.ciiva.com/7660/38590-7660794.pdf?src-supplier=Element14; ComponentLink4URL: https://datasheet.ciiva.com/7746/1868787-7746365.pdf?src-supplier=Element14; ComponentLink4Description: https://datasheet.ciiva.com/7746/1868787-7746365.pdf?src-supplier=Element14; ComponentLink5URL: https://datasheet.ciiva.com/7746/1738695-7746366.pdf?src-supplier=Element14; ComponentLink5Description: https://datasheet.ciiva.com/7746/1738695-7746366.pdf?src-supplier=Element14; ComponentLink6URL: https://datasheet.ciiva.com/22747/443971-22747528.pdf?src-supplier=Element14; ComponentLink6Description: https://datasheet.ciiva.com/22747/443971-22747528.pdf?src-supplier=Element14
R3 R9 = CMP-2100-03663-2: NexarPartId: 55402879; Manufacturer: Yageo; Manufacturer Part Number: RC0603FR-07100RL; Voltage Rating: 50V; Power Rating: 100mW; Tolerance: 1%; Temperature Coefficient: 100ppm/°C; Resistance: 100Ω; Additional Feature: LASER TRIMMABLE; Rated Temperature: 70°C; Working Voltage: 75V; Package Height: 0.45mm; Package Length: 1.6mm; Package Width: 0.8mm; Case/Package: 0603; Military Standard: Not; REACH SVHC: Unknown; Case Code (Metric): 0603; Max Operating Temperature: 155°C; Schedule B: 8533210045, 8533210045; Height: 450µm; Length: 1.6mm; Lead Free: Lead Free; Packaging: Tape & Reel; Case Code (Imperial): 0603; Composition: Thick Film; Min Operating Temperature: -55°C; Voltage Rating (DC): 50V; RoHS: Compliant; Depth: 800µm; Number of Pins: 2; Termination: SMD/SMT; Width: 800µm; Supplier: Digikey; Supplier Part Number: 311-100HRCT-ND; Category: Chip SMD Resistors; Stock: 1540903; Pricing: 1=0.1, 10=0.012, 50=0.0096, 100=0.0071, 500=0.00612, 1000=0.0051 (USD); Mounting Technology: Surface Mount; Pins: 2; Package Shape: Rectangular; Terminal Finish: Nickel; JESD-609 Code: e3; Resistor Type: FIXED RESISTOR; Construction: Chip; Power: 100mW; Value: 100R; Technology: METAL GLAZE/THICK FILM; Reach SVHC Compliant: Yes; RoHS Compliant: Yes; ComponentLink1URL: https://datasheet.ciiva.com:443/pdfs/VipMasterIC/IC/YAGO/YAGO-S-A0008145938/YAGO-S-A0008145938-1.pdf?src-supplier=IHS+Markit; ComponentLink1Description: https://datasheet.ciiva.com:443/pdfs/VipMasterIC/IC/YAGO/YAGO-S-A0008145938/YAGO-S-A0008145938-1.pdf?src-supplier=IHS+Markit
R6 = CMP-1659-00008-4: Chip Resistor, 10 Ohm, +/- 1%, 0.1 W, -55 to 155 degC, 0603 (1608 Metric), RoHS, Tape and Reel; Manufacturer: Yageo; Manufacturer Part Number: RC0603FR-0710RL; Voltage Rating: 50 V; Additional Feature: LASER TRIMMABLE; Power: 100mW; Rated Temperature: 70°C; Temperature Coefficient: 200ppm/°C; Working Voltage: 75V; Package Height: 0.45mm; Package Length: 1.6mm; Package Width: 0.8mm; PackageReference: 0603; ComponentLink3Description: Package Specification; Packaging: Tape and Reel; Max Operating Temperature: 155 degC; ComponentLink3URL: http://www.farnell.com/datasheets/443971.pdf; PackageDescription: 2-Pin Surface Mount Device, Body 1.6 x 0.8 mm; ComponentLink1URL: http://www.yageo.com/; Pins: 2; REACH SVHC: No SVHC; RoHSCompliant: true; ComponentLink2URL: http://www.yageo.com/documents/recent/PYu-RC_Group_51_RoHS_L_04.pdf; DatasheetVersion: Rev. 4, 02/2016; Mount: Surface Mount; Package Quantity: 200; Min Operating Temperature: -55 degC; Height: 0.45 mm; Mounting Technology: Surface Mount; ComponentLink1Description: Manufacturer URL; ComponentLink2Description: Datasheet; Length: 1.6 mm; Supplier: Digikey; Supplier Part Number: 311-10.0HRCT-ND; RoHS: Yes; Category: Chip SMD Resistors; Stock: 46216; Pricing: 1=0.1, 10=0.019, 50=0.0152, 500=0.01122, 1000=0.00918 (USD); Package Shape: Rectangular; Case/Package: 0603; Terminal Finish: Nickel; Tolerance: 1%; JESD-609 Code: e3; Resistor Type: FIXED RESISTOR; Construction: Chip; Value: 10R; Technology: METAL GLAZE/THICK FILM; Termination: Wraparound; Reach SVHC Compliant: Yes; RoHS Compliant: Yes; ComponentLink4URL: https://datasheet.ciiva.com:443/pdfs/VipMasterIC/IC/YAGO/YAGO-S-A0008145938/YAGO-S-A0008145938-1.pdf?src-supplier=IHS+Markit; ComponentLink4Description: https://datasheet.ciiva.com:443/pdfs/VipMasterIC/IC/YAGO/YAGO-S-A0008145938/YAGO-S-A0008145938-1.pdf?src-supplier=IHS+Markit; ComponentLink5URL: https://datasheet.ciiva.com/7746/443971-7746245.pdf?src-supplier=Element14; ComponentLink5Description: https://datasheet.ciiva.com/7746/443971-7746245.pdf?src-supplier=Element14
R22 R23 = CMP-26527-002331-1: 1kΩ ±1% 0.125W 0805 Thick Film Chip Resistor AEC-Q200 compliant; Manufacturer: Stackpole Electronics; Manufacturer Part Number: RMCF0805FT1K00; Resistance: 1kR; Max Power Dissipation: 125mW; Temperature Coefficient: 100ppm/°C; Rated Temperature: 70°C; Value: 1kR; Working Voltage: 150V; Package Height: 0.5mm; Package Length: 2mm; Package Width: 1.25mm; Contact Plating: Tin; Case Code (Imperial): 0805; Radiation Hardening: No; Case/Package: 0805; Min Operating Temperature: -55°C; Construction: Rectangular; Tolerance: 1%; Length: 2mm; Features: Automotive AEC-Q200; Height: 0.026inch; Mount: Surface Mount; Series: RMCF; Number of Terminations: 2; Width: 0.049inch; Packaging: Tape and Reel; Size Code: 0805; Lead Free: Lead Free; Depth: 1.25mm; Power Rating: 125mW; Resistor Type: Thick Film; Case Code (Metric): 2012; Military Standard: Not; Max Operating Temperature: 155°C; RoHS Compliant: Yes; Supplier: Digikey; Supplier Part Number: RMCF0805FT1K00CT-ND; RoHS: Yes; Category: Chip SMD Resistors; Stock: 390730; Pricing: 1=0.1, 10=0.021, 50=0.0126, 100=0.0104, 500=0.00696, 1000=0.00594, 5000=0.00428, 10000=0.00379, 15000=0.00354, 25000=0.00328, 35000=0.00312, 50000=0.00297, 125000=0.00265, 250000=0.00246, 500000=0.00231 (USD); Mounting Technology: Surface Mount; Pins: 2; Package Shape: Rectangular; Terminal Finish: Nickel; JESD-609 Code: e3; Power: 125mW; Technology: METAL GLAZE/THICK FILM; Termination: Wraparound; Reference Standard: AEC-Q200; Reach SVHC Compliant: Yes; ComponentLink1URL: https://datasheet.ciiva.com:443/pdfs/VipMasterIC/IC/SEIE/SEIE-S-A0009541969/SEIE-S-A0009541969-1.pdf?src-supplier=IHS+Markit; ComponentLink1Description: https://datasheet.ciiva.com:443/pdfs/VipMasterIC/IC/SEIE/SEIE-S-A0009541969/SEIE-S-A0009541969-1.pdf?src-supplier=IHS+Markit; ComponentLink2URL: https://datasheet.ciiva.com/15193/getdatasheetpartid-360136-15193546.pdf?src-supplier=Verical; ComponentLink2Description: https://datasheet.ciiva.com/15193/getdatasheetpartid-360136-15193546.pdf?src-supplier=Verical
R24-R28 = R_0R_0603
SW2 SW3 = CMP-1684-00021-1: Tact Switch, SPST-NO, 0.05 A, -35 to 85 degC, 4-Pin THD, RoHS, Bulk; Manufacturer: TE Connectivity; Maximum Contact Resistance: 100mOhm; Mechanical Life: 100000Cycles; Bushing Type: Unthreaded; Switch Configuration: OFF(ON); Maximum DC Voltage Rating: 24V; Contact Rating @ Voltage: 0.05A@24VDC; Actuator Color: Black; Body Orientation: Straight; Function: MomentaryContact; Illumination: N/R; Actuator Style: RoundButton; Actuator Material: PolybutyleneTerephthalate; Dielectric Strength: 500VAC; Pole Throw Configuration: SPST; Actuator Length: 1.4mm; Circuit Configuration: 1X1; Contact Current(DC)-Max: 50mA; Number of Switches: 1; Operating Force-Max: 2.06N; Switch Action: MOMENTARY; Switch Type: Keypad; Contact DC Max Rating R Load: .05A@24VDC; Body Breadth: 5.99inch; Body Height: 3.61mm; Body Length or Diameter: 5.99mm; Product Weight: N/A; Contact Material: CopperAlloy; Housing Material: N/A; Terminal Type: PCPins; Minimum Insulation Resistance: 100MOhm; Package Description: 4-Pin Through Hole Device, Body 5.99 x 5.99 mm, Pitch 6.5 mm; Part No: 1825910-6; Package Reference: THD; Base Material: N/A; Manufacturer URL: http://www.te.com; Contact Plating: Silver; RoHS: Yes; Datasheet Version: Rev. C9; Electrical Life: 100000Cycles; Maximum AC Voltage Rating: N/A; Thread Size: N/R; Operating Temperature: -35to85C; Mounting: ThroughHole; Dimension: 5.99x5mm; Datasheet URL: http://www.te.com/commerce/DocumentDelivery/DDEController?Action=showdoc&DocId=Customer+Drawing%7F1825910%7FC9%7Fpdf%7FEnglish%7FENG_CD_1825910_C9.pdf%7F1825910-6; Family: 1825910; Seal Location: N/A; Seal Description: N/A; Packaging: N/A; Supplier: Digikey; Supplier Part Number: 450-1650-ND; Manufacturer Part Number: 1825910-6; Category: Pushbutton Switches; Stock: 87502; Pricing: 1=0.16, 10=0.132, 25=0.1216, 100=0.1072, 250=0.09864, 750=0.08917, 1500=0.08362, 3000=0.07836, 5250=0.07432 (USD); Mounting Technology: Through Hole; Min Operating Temperature: -35°C; Max Operating Temperature: 85°C; Termination: Solder; Contact Voltage(DC)-Max: 24V; Switch Function: SPST; Reach SVHC Compliant: Yes; RoHS Compliant: Yes; ComponentLink1URL: https://datasheet.ciiva.com:443/pdfs/VipMasterIC/IC/TYEL/TYEL-S-A0008869674/TYEL-S-A0008850909-1.pdf?src-supplier=IHS+Markit; ComponentLink1Description: https://datasheet.ciiva.com:443/pdfs/VipMasterIC/IC/TYEL/TYEL-S-A0008869674/TYEL-S-A0008850909-1.pdf?src-supplier=IHS+Markit; ComponentLink2URL: https://datasheet.ciiva.com/30199/1825910-6rqpn1825910-6-30199520.pdf?src-supplier=Onlinecomponents.com; ComponentLink2Description: https://datasheet.ciiva.com/30199/1825910-6rqpn1825910-6-30199520.pdf?src-supplier=Onlinecomponents.com; ComponentLink3URL: https://datasheet.ciiva.com/15184/getdatasheetpartid-395915-15184509.pdf?src-supplier=Verical; ComponentLink3Description: https://datasheet.ciiva.com/15184/getdatasheetpartid-395915-15184509.pdf?src-supplier=Verical
U1 = EFR32BG24A020F1024IM48-B: BG24, 2.4 GHz, 1024kB Flash, 128kB RAM, +20 dBm, +125C, QFN48; Manufacturer: Silicon Labs; Supplier: Digikey; Supplier Part Number: 336-EFR32BG24A020F1024IM48-B-ND; Manufacturer Part Number: EFR32BG24A020F1024IM48-B; RoHS: No; Category: RF Receivers, Transceivers; Stock: 525; Pricing: 1=6.45, 10=5.757, 25=5.1812, 80=4.72075, 230=4.26017, 490=3.82265, 980=3.22392 (USD)
U2 = TMP117MAIDRVR: 0.1°C digital temperature sensor, 48-bit EEPROM, PT100/PT1000 RTD replacement 6-WSON 0 to 85; Manufacturer: Texas Instruments; Output Type: I2C; Resolution: 16b; Supplier: Digikey; Supplier Part Number: 296-51835-1-ND; Manufacturer Part Number: TMP117MAIDRVR; RoHS: Yes; Category: Integrated Circuits (ICs); Stock: 10742; Pricing: 1=2.89, 5=2.438, 10=2.265, 25=2.0552, 50=1.9098, 100=1.7747, 500=1.49702, 1000=1.39131 (USD); Mounting Technology: Surface Mount; Pins: 6; Min Operating Temperature: -55°C; Max Operating Temperature: 150°C; Packaging: Cut Tape; Series: -; Length: 2mm; Width: 2mm; Height: 800um; Thickness: 750um; RoHS Compliant: Yes; ComponentLink1URL: http://www.ti.com/lit/gpn/tmp117?src-supplier=Digikey; ComponentLink1Description: http://www.ti.com/lit/gpn/tmp117?src-supplier=Digikey; ComponentLink2URL: http://www.ti.com/lit/ds/symlink/tmp117.pdf?src-supplier=Digikey; ComponentLink2Description: http://www.ti.com/lit/ds/symlink/tmp117.pdf?src-supplier=Digikey
U3 = MAX30102EFD+T: High-Sensitivity Pulse Oximeter and Heart-Rate Sensor for Fitness & Healthcare; Manufacturer: Maxim; Manufacturer Part Number: MAX30101EFD+T; Output Type: I2C; Supplier: Digikey; Supplier Part Number: MAX30101EFD+TCT-ND; RoHS: Yes; Category: Sensors; Stock: 5421; Pricing: 1=14.05, 10=9.978, 25=8.9312, 100=7.761, 250=7.19452, 500=6.84968, 1000=6.675 (USD); Min Operating Temperature: -40°C; Max Operating Temperature: 85°C; Series: -; Packaging: Cut Tape; RoHS Compliant: Yes; ComponentLink1URL: https://datasheets.maximintegrated.com/en/ds/MAX30101.pdf?src-supplier=Digikey; ComponentLink1Description: https://datasheets.maximintegrated.com/en/ds/MAX30101.pdf?src-supplier=Digikey; ComponentLink2URL: https://datasheet.octopart.com/MAX30101EFD%2BT-Analog-Devices-datasheet-65703272.pdf?src-supplier=Newark; ComponentLink2Description: https://datasheet.octopart.com/MAX30101EFD%2BT-Analog-Devices-datasheet-65703272.pdf?src-supplier=Newark
U4 = BMA400: BMA400 Series 3.6 V ±2g/4g/8g/16g 3 Axes Ultra Low Power Accelerometer - LGA-12; Manufacturer: Bosch Tools; Supplier: Digikey; Supplier Part Number: 828-1081-1-ND; Manufacturer Part Number: BMA400; RoHS: No; Category: Accelerometers; Stock: 19432; Pricing: 1=3.56, 5=3.004, 10=2.791, 25=2.5328, 50=2.3534, 100=2.187, 500=1.84486, 1000=1.71463, 5000=1.44679 (USD)
U5 = MAX32664GTGA+T: Biometric Sensor Hub Finger-Based Algorithm I2C Interface 1.71V to 3.63V 24-Pin TQFN EP T/R; Manufacturer: Maxim; Input Type: DIGITAL; Supplier: Digikey; Supplier Part Number: 175-MAX32664GTGA+TCT-ND; Manufacturer Part Number: MAX32664GTGA+T; RoHS: Yes; Category: Microcontrollers; Stock: 2409; Pricing: 1=6.75, 10=4.579, 25=4.0184, 100=3.3901, 250=3.08532, 500=2.89958, 1000=2.74535 (USD); Mounting Technology: Surface Mount; Min Operating Temperature: -40°C; Max Operating Temperature: 105°C; Output Type: I2C; Series: -; RoHS Compliant: Yes; ComponentLink1URL: https://datasheet.octopart.com/MAX32664GTGA%2BT-Maxim-Integrated-datasheet-158912049.pdf?src-supplier=Farnell; ComponentLink1Description: https://datasheet.octopart.com/MAX32664GTGA%2BT-Maxim-Integrated-datasheet-158912049.pdf?src-supplier=Farnell
U7 = MIC5365-1.8YC5-TR: Linear Voltage Regulator IC 1 Output 150mA SC-70-5; MF: Microchip; Package: SC-70-5 Microchip; Purchase-URL: https://pricing.snapeda.com/search/part/MIC5365-1.8YC5-TR/?ref=eda; Price: None; Availability: Good; Check_prices: https://www.snapeda.com/parts/MIC5365-1.8YC5-TR/Microchip/view-part/490561/?ref=eda; MP: MIC5365-1.8YC5-TR; SnapEDA_Link: https://www.snapeda.com/parts/MIC5365-1.8YC5-TR/Microchip/view-part/490561/?ref=snap; Value: *
Y2 = CMP-2000-07587-2: CRYSTAL 32.7680KHZ 6PF SMD; Manufacturer: Abracon; Frequency Tolerance: 20ppm; Series Resistance: 60kR; ESR (Equivalent Series Resistance): 55kR; Aging: 3 PPM/FIRST YEAR; Crystal/Resonator Type: PARALLEL - FUNDAMENTAL; Drive Level: 0.1uW; Operating Frequency-Nom: 0.032768; Frequency Stability: 0.009%; Depth: 1.5mm; Width: 0.061inch; Number of Pins: 2; Max Operating Temperature: 85°C; Length: 3.2mm; Case/Package: SMD/SMT; Series: ABS07; Lead Free: Lead Free; Min Operating Temperature: -40°C; Load Capacitance: 6pF; Packaging: Tape and Reel; Height: 0.035inch; Radiation Hardening: No; Tolerance: 20ppm; Operating Frequency: 32.768 kHz; Termination: SMD/SMT; REACH SVHC: No SVHC; RoHS Compliant: Yes; Frequency: 32.768kHz; Package Quantity: 3000; Mount: Surface Mount; Supplier: Digikey; Supplier Part Number: 535-11937-1-ND; Manufacturer Part Number: ABS07-120-32.768KHZ-T; RoHS: Yes; Category: Crystals; Stock: 122345; Pricing: 1=0.82, 10=0.703, 50=0.6338, 100=0.6063, 500=0.54694, 1000=0.52332 (USD); Mounting Technology: Surface Mount; ESR: 55kR; Reach SVHC Compliant: Yes; ComponentLink1URL: https://datasheet.ciiva.com:443/pdfs/VipMasterIC/IC/ABRC/ABRCS02965/ABRCS02965-1.pdf?src-supplier=IHS+Markit; ComponentLink1Description: https://datasheet.ciiva.com:443/pdfs/VipMasterIC/IC/ABRC/ABRCS02965/ABRCS02965-1.pdf?src-supplier=IHS+Markit; ComponentLink2URL: https://datasheet.ciiva.com/6728/abs07-120-32-768khz-t-6728893.pdf?src-supplier=Digikey; ComponentLink2Description: https://datasheet.ciiva.com/6728/abs07-120-32-768khz-t-6728893.pdf?src-supplier=Digikey; ComponentLink3URL: https://datasheet.ciiva.com/15214/getdatasheetpartid-722402-15214953.pdf?src-supplier=Verical; ComponentLink3Description: https://datasheet.ciiva.com/15214/getdatasheetpartid-722402-15214953.pdf?src-supplier=Verical; ComponentLink4URL: https://datasheet.ciiva.com/12387/abs07-120-32-768khz-t-218607-12387629.pdf?src-supplier=Mouser; ComponentLink4Description: https://datasheet.ciiva.com/12387/abs07-120-32-768khz-t-218607-12387629.pdf?src-supplier=Mouser